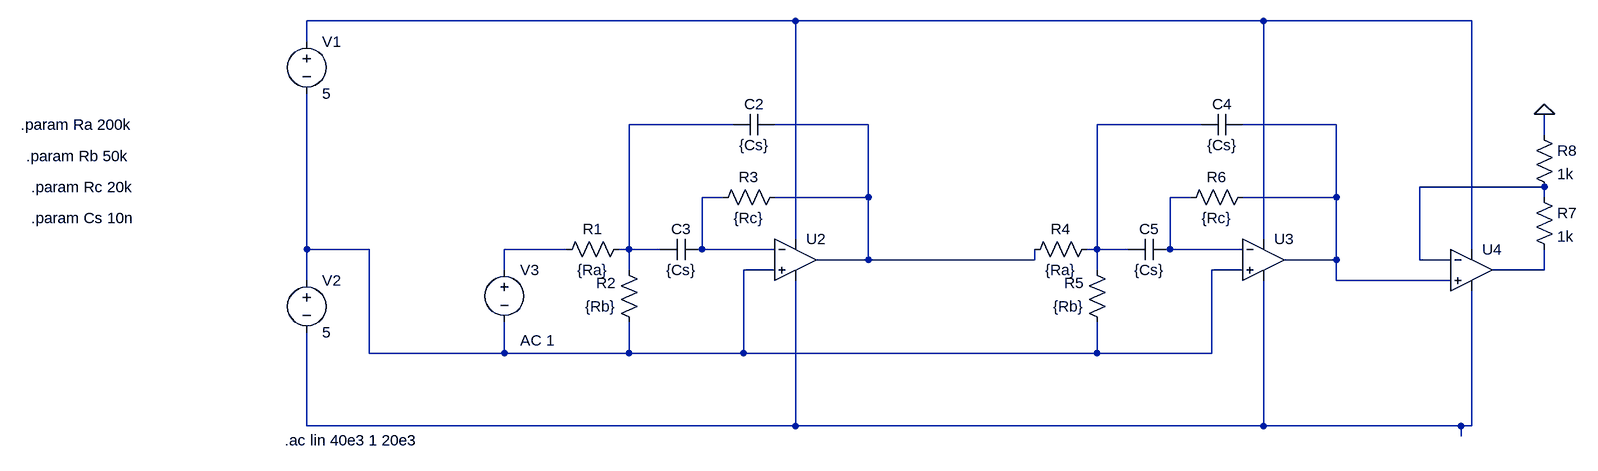
[diagram p0: schematic one_stage_MFB.asc]
one_stage_MFB.asc, the LTspice schematic file:
Version 4
SHEET 1 952 984
WIRE -256 320 -1008 320
WIRE 464 320 -256 320
WIRE 784 320 464 320
WIRE -1008 352 -1008 320
WIRE -352 480 -512 480
WIRE -144 480 -288 480
WIRE 368 480 208 480
WIRE 576 480 432 480
WIRE 896 496 896 464
WIRE 896 576 704 576
WIRE -368 592 -400 592
WIRE -144 592 -144 480
WIRE -144 592 -288 592
WIRE 352 592 320 592
WIRE 576 592 576 480
WIRE 576 592 432 592
WIRE 896 592 896 576
WIRE -256 656 -256 320
WIRE 464 656 464 320
WIRE -1008 672 -1008 432
WIRE -912 672 -1008 672
WIRE -608 672 -704 672
WIRE -512 672 -512 480
WIRE -512 672 -528 672
WIRE -464 672 -512 672
WIRE -400 672 -400 592
WIRE -288 672 -400 672
WIRE 208 672 208 480
WIRE 208 672 192 672
WIRE 256 672 208 672
WIRE 320 672 320 592
WIRE 432 672 320 672
WIRE 784 672 784 320
WIRE -144 688 -144 592
WIRE -144 688 -224 688
WIRE 112 688 112 672
WIRE 112 688 -144 688
WIRE 576 688 576 592
WIRE 576 688 496 688
WIRE 704 688 704 576
WIRE 752 688 704 688
WIRE -704 704 -704 672
WIRE -512 704 -512 672
WIRE -288 704 -336 704
WIRE 208 704 208 672
WIRE 432 704 384 704
WIRE 896 704 896 672
WIRE 896 704 816 704
WIRE -1008 720 -1008 672
WIRE 576 720 576 688
WIRE 752 720 576 720
WIRE -912 832 -912 672
WIRE -704 832 -704 784
WIRE -704 832 -912 832
WIRE -512 832 -512 784
WIRE -512 832 -704 832
WIRE -336 832 -336 704
WIRE -336 832 -512 832
WIRE 208 832 208 784
WIRE 208 832 -336 832
WIRE 384 832 384 704
WIRE 384 832 208 832
WIRE -1008 944 -1008 800
WIRE -256 944 -256 720
WIRE -256 944 -1008 944
WIRE 464 944 464 720
WIRE 464 944 -256 944
WIRE 768 944 464 944
WIRE 784 944 784 736
WIRE 784 944 768 944
WIRE 768 960 768 944
FLAG 896 464 0
DATAFLAG -144 704 ""
DATAFLAG -144 576 ""
DATAFLAG -144 592 ""
DATAFLAG -144 592 ""
SYMBOL res -512 656 R90
WINDOW 0 0 56 VBottom 2
WINDOW 3 32 56 VTop 2
SYMATTR InstName R1
SYMATTR Value {Ra}
SYMBOL res -496 800 R180
WINDOW 0 36 76 Left 2
WINDOW 3 36 40 Left 2
SYMATTR InstName R2
SYMATTR Value {Rb}
SYMBOL res -384 608 R270
WINDOW 0 32 56 VTop 2
WINDOW 3 0 56 VBottom 2
SYMATTR InstName R3
SYMATTR Value {Rc}
SYMBOL cap -288 464 R90
WINDOW 0 0 32 VBottom 2
WINDOW 3 32 32 VTop 2
SYMATTR InstName C2
SYMATTR Value {Cs}
SYMBOL cap -400 656 R90
WINDOW 0 0 32 VBottom 2
WINDOW 3 32 32 VTop 2
SYMATTR InstName C3
SYMATTR Value {Cs}
SYMBOL OpAmps\\UniversalOpAmp -256 688 R0
SYMATTR InstName U2
SYMBOL res 208 656 R90
WINDOW 0 0 56 VBottom 2
WINDOW 3 32 56 VTop 2
SYMATTR InstName R4
SYMATTR Value {Ra}
SYMBOL res 224 800 R180
WINDOW 0 36 76 Left 2
WINDOW 3 36 40 Left 2
SYMATTR InstName R5
SYMATTR Value {Rb}
SYMBOL res 336 608 R270
WINDOW 0 32 56 VTop 2
WINDOW 3 0 56 VBottom 2
SYMATTR InstName R6
SYMATTR Value {Rc}
SYMBOL cap 432 464 R90
WINDOW 0 0 32 VBottom 2
WINDOW 3 32 32 VTop 2
SYMATTR InstName C4
SYMATTR Value {Cs}
SYMBOL cap 320 656 R90
WINDOW 0 0 32 VBottom 2
WINDOW 3 32 32 VTop 2
SYMATTR InstName C5
SYMATTR Value {Cs}
SYMBOL OpAmps\\UniversalOpAmp 464 688 R0
SYMATTR InstName U3
SYMBOL OpAmps\\UniversalOpAmp 784 704 R0
SYMATTR InstName U4
SYMBOL res 880 576 R0
SYMATTR InstName R7
SYMATTR Value 1k
SYMBOL res 880 480 R0
SYMATTR InstName R8
SYMATTR Value 1k
SYMBOL voltage -1008 336 R0
WINDOW 123 0 0 Left 0
WINDOW 39 0 0 Left 0
SYMATTR InstName V1
SYMATTR Value 5
SYMBOL voltage -1008 704 R0
WINDOW 123 0 0 Left 0
WINDOW 39 0 0 Left 0
SYMATTR InstName V2
SYMATTR Value 5
SYMBOL voltage -704 688 R0
WINDOW 123 24 124 Left 2
WINDOW 39 0 0 Left 0
SYMATTR InstName V3
SYMATTR Value ""
SYMATTR Value2 AC 1
TEXT -1042 966 Left 2 !.ac lin 40e3 1 20e3
TEXT -1448 480 Left 2 !.param Ra 200k
TEXT -1440 528 Left 2 !.param Rb 50k
TEXT -1432 576 Left 2 !.param Rc 20k
TEXT -1432 624 Left 2 !.param Cs 10n

The netlist it stands for:
* one_stage_MFB.asc
R1 N002 N010 {Ra}
R2 N009 N002 {Rb}
R3 N007 N003 {Rc}
C2 N003 N002 {Cs}
C3 N007 N002 {Cs}
XU2 N009 N007 N001 N012 N003 level1 Avol=1Meg GBW=10Meg Vos=0 En=0 Enk=0 In=0 Ink=0 Rin=500Meg  ; pins In+ In- V+ V- OUT
R4 N004 N003 {Ra}
R5 N009 N004 {Rb}
R6 N008 N005 {Rc}
C4 N005 N004 {Cs}
C5 N008 N004 {Cs}
XU3 N009 N008 N001 N012 N005 level1 Avol=1Meg GBW=10Meg Vos=0 En=0 Enk=0 In=0 Ink=0 Rin=500Meg  ; pins In+ In- V+ V- OUT
XU4 N005 N006 N001 N012 N011 level1 Avol=1Meg GBW=10Meg Vos=0 En=0 Enk=0 In=0 Ink=0 Rin=500Meg  ; pins In+ In- V+ V- OUT
R7 N006 N011 1k
R8 0 N006 1k
V1 N001 N009 5
V2 N009 N012 5
V3 N010 N009 AC 1
.ac lin 40e3 1 20e3
.param Ra 200k
.param Rb 50k
.param Rc 20k
.param Cs 10n
.lib UniversalOpAmp1.lib
.backanno
.end